# Altium schematic sheet Antenna_base.SchDoc
size A2
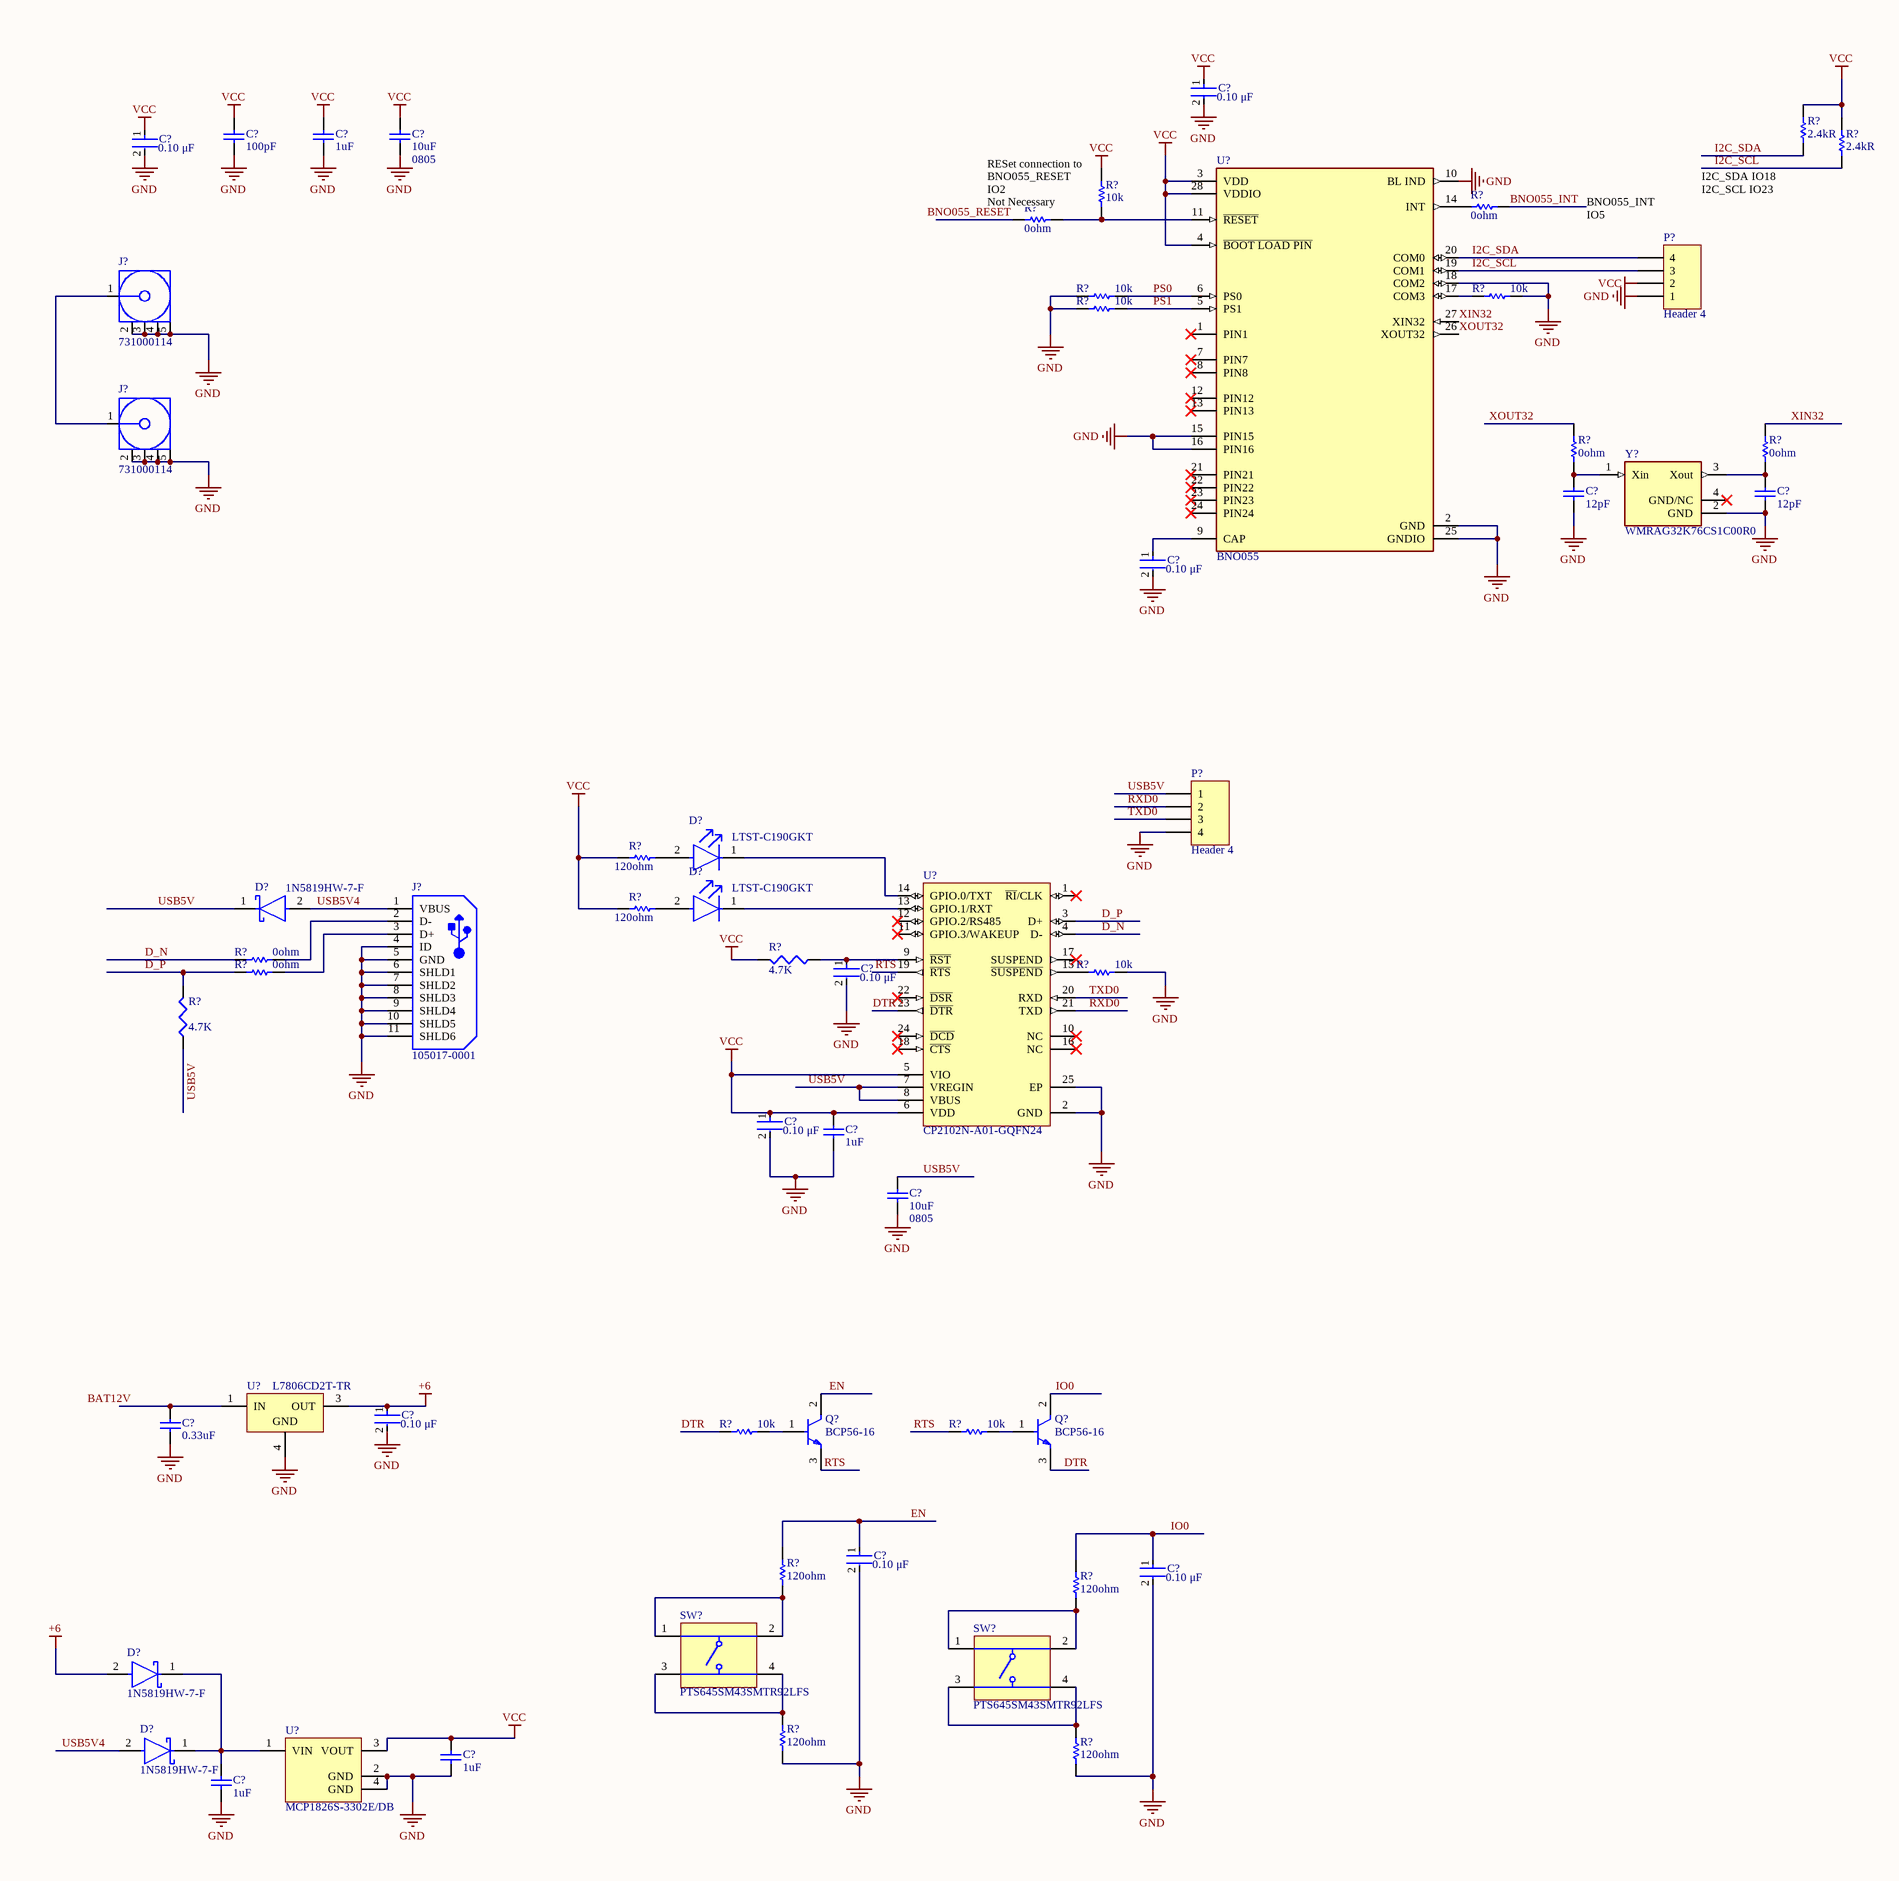
[diagram p0: Antenna_base.SchDoc, left]
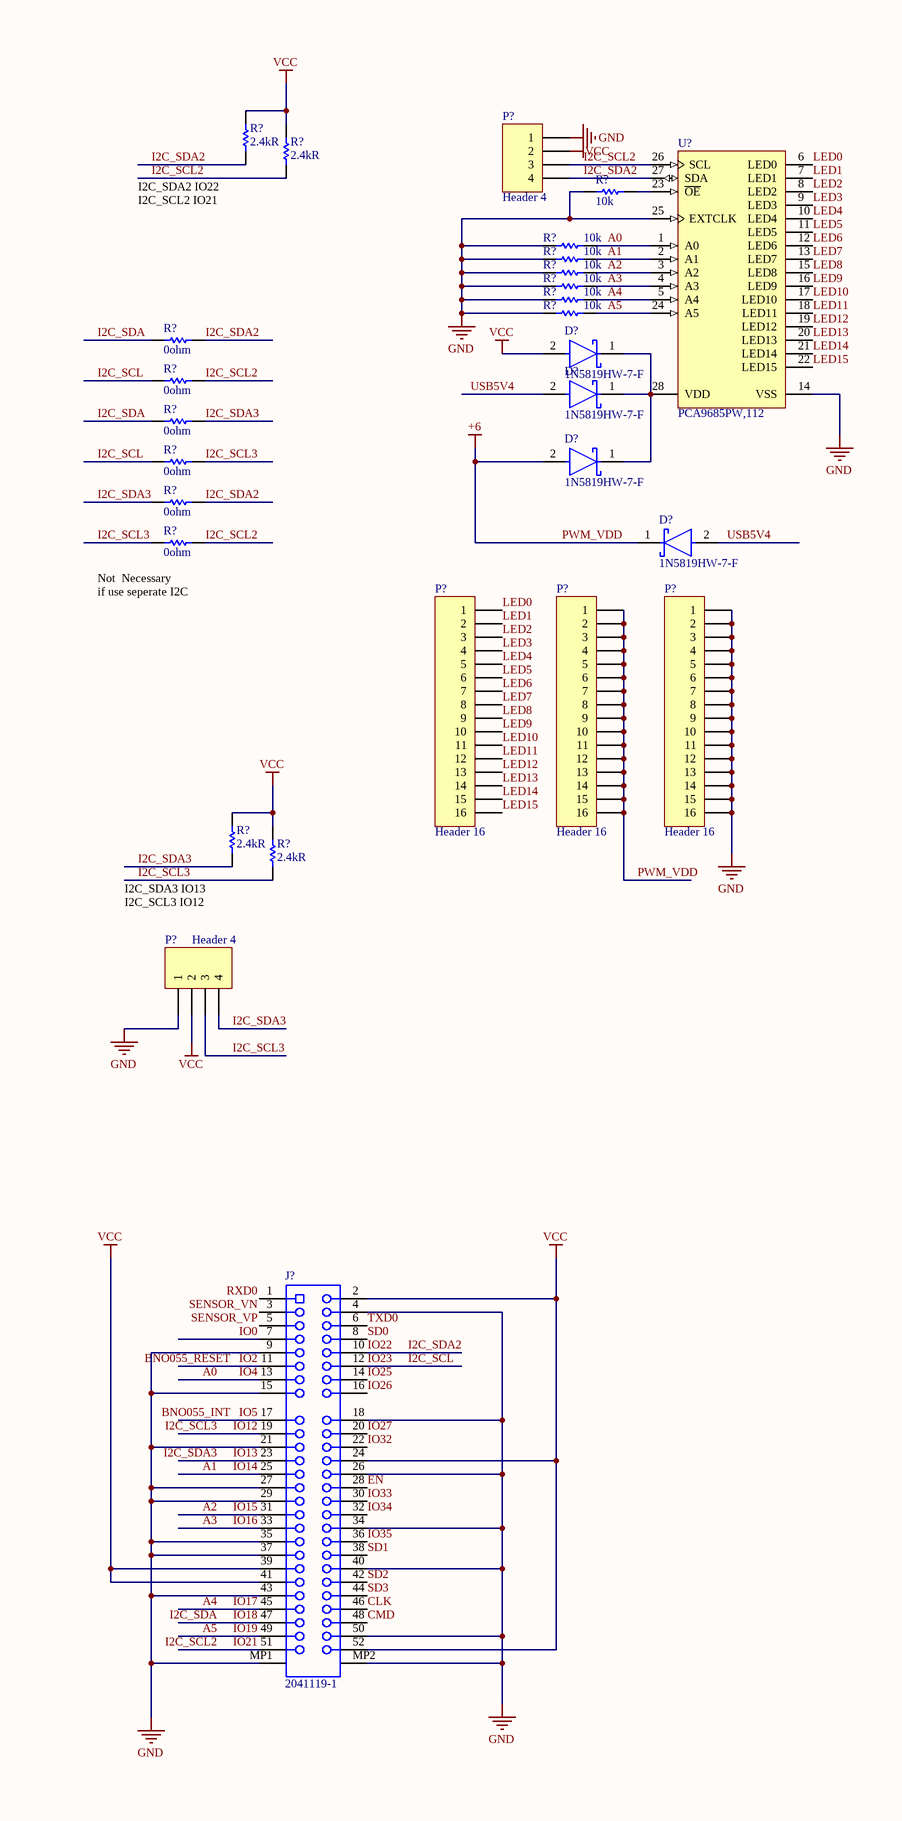
[diagram p1: Antenna_base.SchDoc, right]

## Parts
(Parts that share a designator on the sheet are numbered #1, #2 ... from top to bottom, then left to right.)
C?#1  Capacitance: 0.10 μF  [FP-C0603C-CF-MFG]  (hidden comment: C0603C104M4RAC7411)
C?#2  Capacitance: 0.10 μF  [FP-C0603C-CF-MFG]  (hidden comment: C0603C104M4RAC7411)
C?#3  value 100pF  [CAPC1608X87X35LL15T15]  (hidden comment: C0603C101J1GACTU)
C?#4  value 1uF  [CAPC1608X87X35LL15T15]  (hidden comment: C0603C101J1GACTU)
C?#5  value 10uF  Package: 0805  [CAPC2013X135X50LL10T20]  (hidden comment: GRM21BR61C106KE15L)
C?#6  value 12pF  [CAPC1608X90X40NL10T20]  (hidden comment: CC0603JRNPO9BN120)
C?#7  value 12pF  [CAPC1608X90X40NL10T20]  (hidden comment: CC0603JRNPO9BN120)
C?#8  Capacitance: 0.10 μF  [FP-C0603C-CF-MFG]  (hidden comment: C0603C104M4RAC7411)
C?#9  Capacitance: 0.10 μF  [FP-C0603C-CF-MFG]  (hidden comment: C0603C104M4RAC7411)
C?#10  Capacitance: 0.10 μF  [FP-C0603C-CF-MFG]  (hidden comment: C0603C104M4RAC7411)
C?#11  value 1uF  [CAPC1608X87X35LL15T15]  (hidden comment: C0603C101J1GACTU)
C?#12  value 10uF  Package: 0805  [CAPC2013X135X50LL10T20]  (hidden comment: GRM21BR61C106KE15L)
C?#13  Capacitance: 0.10 μF  [FP-C0603C-CF-MFG]  (hidden comment: C0603C104M4RAC7411)
C?#14  value 0.33uF  [CAPC1608X90X20LL10]  (hidden comment: C1608X7R1H334K080AC)
C?#15  Capacitance: 0.10 μF  [FP-C0603C-CF-MFG]  (hidden comment: C0603C104M4RAC7411)
C?#16  Capacitance: 0.10 μF  [FP-C0603C-CF-MFG]  (hidden comment: C0603C104M4RAC7411)
C?#17  value 1uF  [CAPC1608X87X35LL15T15]  (hidden comment: C0603C101J1GACTU)
C?#18  value 1uF  [CAPC1608X87X35LL15T15]  (hidden comment: C0603C101J1GACTU)
D?#1  1N5819HW-7-F  [FP-SOD123-MFG]
D?#2  1N5819HW-7-F  [FP-SOD123-MFG]
D?#3  1N5819HW-7-F  [FP-SOD123-MFG]
D?#4  1N5819HW-7-F  [FP-SOD123-MFG]
D?#5  LTST-C190GKT  [FP-LTST-C190GKT-MFG]
D?#6  1N5819HW-7-F  [FP-SOD123-MFG]
D?#7  LTST-C190GKT  [FP-LTST-C190GKT-MFG]
D?#8  1N5819HW-7-F  [FP-SOD123-MFG]
D?#9  1N5819HW-7-F  [FP-SOD123-MFG]
J?#1  731000114  [MOLX-731000114_V]
J?#2  731000114  [MOLX-731000114_V]
J?#3  105017-0001  [USB-MICRO-B_V]
J?#4  2041119-1  [TECO-2041119-1_3_V]
P?#1  Header 4  [HDR1X4]
P?#2  Header 4  [HDR1X4]
P?#3  Header 16  [HDR1X16]
P?#4  Header 16  [HDR1X16]
P?#5  Header 16  [HDR1X16]
P?#6  Header 4  [HDR1X4]
P?#7  Header 4  [HDR1X4]
Q?#1  BCP56-16  [FP-SOT-223-P008-MFG]
Q?#2  BCP56-16  [FP-SOT-223-P008-MFG]
R?#1  value 2.4kR  [RESC1608X50X30ML20T20]  (hidden comment: RR0816P-242-D)
R?#2  value 2.4kR  [RESC1608X50X30ML20T20]  (hidden comment: RR0816P-242-D)
R?#3  value 2.4kR  [RESC1608X50X30ML20T20]  (hidden comment: RR0816P-242-D)
R?#4  value 2.4kR  [RESC1608X50X30ML20T20]  (hidden comment: RR0816P-242-D)
R?#5  value 10k  [RESC1609X55X30LL15T15]  (hidden comment: ERJ3EKF1002V)
R?#6  value 10k  [RESC1609X55X30LL15T15]  (hidden comment: ERJ3EKF1002V)
R?#7  value 0ohm  [RESC1608X55X25ML10T15]  (hidden comment: RC0603JR-070RL)
R?#8  value 0ohm  [RESC1608X55X25ML10T15]  (hidden comment: RC0603JR-070RL)
R?#9  value 10k  [RESC1609X55X30LL15T15]  (hidden comment: ERJ3EKF1002V)
R?#10  value 10k  [RESC1609X55X30LL15T15]  (hidden comment: ERJ3EKF1002V)
R?#11  value 10k  [RESC1609X55X30LL15T15]  (hidden comment: ERJ3EKF1002V)
R?#12  value 10k  [RESC1609X55X30LL15T15]  (hidden comment: ERJ3EKF1002V)
R?#13  value 10k  [RESC1609X55X30LL15T15]  (hidden comment: ERJ3EKF1002V)
R?#14  value 10k  [RESC1609X55X30LL15T15]  (hidden comment: ERJ3EKF1002V)
R?#15  value 10k  [RESC1609X55X30LL15T15]  (hidden comment: ERJ3EKF1002V)
R?#16  value 10k  [RESC1609X55X30LL15T15]  (hidden comment: ERJ3EKF1002V)
R?#17  value 10k  [RESC1609X55X30LL15T15]  (hidden comment: ERJ3EKF1002V)
R?#18  value 0ohm  [RESC1608X55X25ML10T15]  (hidden comment: RC0603JR-070RL)
R?#19  value 0ohm  [RESC1608X55X25ML10T15]  (hidden comment: RC0603JR-070RL)
R?#20  value 0ohm  [RESC1608X55X25ML10T15]  (hidden comment: RC0603JR-070RL)
R?#21  value 0ohm  [RESC1608X55X25ML10T15]  (hidden comment: RC0603JR-070RL)
R?#22  value 0ohm  [RESC1608X55X25ML10T15]  (hidden comment: RC0603JR-070RL)
R?#23  value 0ohm  [RESC1608X55X25ML10T15]  (hidden comment: RC0603JR-070RL)
R?#24  value 0ohm  [RESC1608X55X25ML10T15]  (hidden comment: RC0603JR-070RL)
R?#25  value 0ohm  [RESC1608X55X25ML10T15]  (hidden comment: RC0603JR-070RL)
R?#26  value 2.4kR  [RESC1608X50X30ML20T20]  (hidden comment: RR0816P-242-D)
R?#27  value 2.4kR  [RESC1608X50X30ML20T20]  (hidden comment: RR0816P-242-D)
R?#28  value 120ohm  [RESC1608X55X30NL20T20]  (hidden comment: ERA-3AEB121V)
R?#29  value 120ohm  [RESC1608X55X30NL20T20]  (hidden comment: ERA-3AEB121V)
R?#30  value 0ohm  [RESC1608X55X25ML10T15]  (hidden comment: RC0603JR-070RL)
R?#31  value 0ohm  [RESC1608X55X25ML10T15]  (hidden comment: RC0603JR-070RL)
R?#32  4.7k  [J1-0603]
R?#33  value 10k  [RESC1609X55X30LL15T15]  (hidden comment: ERJ3EKF1002V)
R?#34  4.7k  [J1-0603]
R?#35  value 10k  [RESC1609X55X30LL15T15]  (hidden comment: ERJ3EKF1002V)
R?#36  value 10k  [RESC1609X55X30LL15T15]  (hidden comment: ERJ3EKF1002V)
R?#37  value 120ohm  [RESC1608X55X30NL20T20]  (hidden comment: ERA-3AEB121V)
R?#38  value 120ohm  [RESC1608X55X30NL20T20]  (hidden comment: ERA-3AEB121V)
R?#39  value 120ohm  [RESC1608X55X30NL20T20]  (hidden comment: ERA-3AEB121V)
R?#40  value 120ohm  [RESC1608X55X30NL20T20]  (hidden comment: ERA-3AEB121V)
SW?#1  PTS645SM43SMTR92LFS  [ITT-PTS645S-4_V]
SW?#2  PTS645SM43SMTR92LFS  [ITT-PTS645S-4_V]
U?#1  PCA9685PW,112  [SOT361-1_V]
U?#2  BNO055  [FP-BNO055-MFG]
U?#3  CP2102N-A01-GQFN24  [SLAB-QFN-24-2550x2550TP_A_V]
U?#4  L7806CD2T-TR  [TO-263_L]
U?#5  MCP1826S-3302E/DB  [SOT-223-DB3_L]
Y?  WMRAG32K76CS1C00R0  [FP-WMRAG32K76CS1C00R0-MFG]

## Nets
GND: C?#1.2 C?#2.2 C?#3.1 C?#4.1 C?#5.1 C?#6.1 C?#7.1 C?#8.2 C?#9.2 C?#10.2 C?#11.1 C?#12.1 C?#13.2 C?#14.1 C?#15.2 C?#16.2 C?#17.1 C?#18.1 J?#1.2 J?#1.3 J?#1.4 J?#1.5 J?#2.2 J?#2.3 J?#2.4 J?#2.5 J?#3.4(ID) J?#3.5(GND) J?#3.6(SHLD1) J?#3.7(SHLD2) J?#3.8(SHLD3) J?#3.9(SHLD4) J?#3.10(SHLD5) J?#3.11(SHLD6) J?#4.4 J?#4.9 J?#4.15 J?#4.18 J?#4.21 J?#4.26 J?#4.27 J?#4.29 J?#4.34 J?#4.35 J?#4.37 J?#4.40 J?#4.43 J?#4.50 J?#4.MP1 J?#4.MP2 P?#1.1 P?#2.1 P?#5.1 P?#5.2 P?#5.3 P?#5.4 P?#5.5 P?#5.6 P?#5.7 P?#5.8 P?#5.9 P?#5.10 P?#5.11 P?#5.12 P?#5.13 P?#5.14 P?#5.15 P?#5.16 P?#6.4 P?#7.1 R?#5.2 R?#9.2 R?#10.2 R?#11.2 R?#12.2 R?#13.2 R?#14.1 R?#15.1 R?#16.2 R?#17.1 R?#33.2 R?#39.1 R?#40.1 U?#1.14(VSS) U?#1.25(EXTCLK) U?#2.2(GND) U?#2.10(BL_IND) U?#2.15(PIN15) U?#2.16(PIN16) U?#2.18(COM2) U?#2.25(GNDIO) U?#3.2(GND) U?#3.25(EP) U?#4.4(GND) U?#5.2(GND) U?#5.4(GND) Y?.2(GND)
PWM_VDD: C?#13.1 D?#3.2(A) D?#4.1(C) D?#8.2(A) P?#4.1 P?#4.2 P?#4.3 P?#4.4 P?#4.5 P?#4.6 P?#4.7 P?#4.8 P?#4.9 P?#4.10 P?#4.11 P?#4.12 P?#4.13 P?#4.14 P?#4.15 P?#4.16 U?#4.3(OUT)  [also labelled +6]
VCC: C?#1.1 C?#2.1 C?#3.2 C?#4.2 C?#5.2 C?#10.1 C?#11.2 C?#17.2 D?#1.2(A) J?#4.2 J?#4.24 J?#4.39 J?#4.41 J?#4.52 P?#1.2 P?#2.2 P?#7.2 R?#1.2 R?#2.2 R?#3.2 R?#4.2 R?#6.2 R?#26.2 R?#27.2 R?#28.1 R?#29.1 R?#32.2 U?#2.3(VDD) U?#2.4(~{BOOT_LOAD_PIN}) U?#2.28(VDDIO) U?#3.5(VIO) U?#3.6(VDD) U?#5.3(VOUT)
A0: J?#4.13 R?#9.1 U?#1.1(A0)  [also labelled IO4]
A1: J?#4.25 R?#10.1 U?#1.2(A1)  [also labelled IO14]
A2: J?#4.31 R?#11.1 U?#1.3(A2)  [also labelled IO15]
A3: J?#4.33 R?#12.1 U?#1.4(A3)  [also labelled IO16]
A4: J?#4.45 R?#13.1 U?#1.5(A4)  [also labelled IO17]
A5: J?#4.49 R?#16.1 U?#1.24(A5)  [also labelled IO19]
BAT12V: C?#14.2 U?#4.1(IN)
BNO055_INT: J?#4.17 R?#7.2  [also labelled IO5]
BNO055_RESET: J?#4.11 R?#8.1  [also labelled IO2]
CLK: J?#4.46
CMD: J?#4.48
D_N: R?#30.1 U?#3.4(D-)
D_P: R?#31.1 R?#34.2 U?#3.3(D+)
DTR: Q?#2.3(E) R?#35.1 U?#3.23(~{DTR})
EN: C?#15.1 J?#4.28 Q?#1.2(C) R?#37.2
I2C_SCL: J?#4.12 P?#2.3 R?#3.1 R?#19.1 R?#23.1 U?#2.19(COM1)  [also labelled IO23]
I2C_SCL2: J?#4.51 P?#1.3 R?#4.1 R?#19.2 R?#25.2 U?#1.26(SCL)  [also labelled IO21]
I2C_SCL3: J?#4.19 P?#7.3 R?#23.2 R?#25.1 R?#27.1  [also labelled IO12]
I2C_SDA: J?#4.47 P?#2.4 R?#1.1 R?#18.1 R?#20.1 U?#2.20(COM0)  [also labelled IO18]
I2C_SDA2: J?#4.10 P?#1.4 R?#2.1 R?#18.2 R?#24.2 U?#1.27(SDA)  [also labelled IO22]
I2C_SDA3: J?#4.23 P?#7.4 R?#20.2 R?#24.1 R?#26.1  [also labelled IO13]
IO0: C?#16.1 J?#4.7 Q?#2.2(C) R?#38.2
IO25: J?#4.14
IO26: J?#4.16
IO27: J?#4.20
IO32: J?#4.22
IO33: J?#4.30
IO34: J?#4.32
IO35: J?#4.36
LED0: P?#3.1 U?#1.6(LED0)
LED1: P?#3.2 U?#1.7(LED1)
LED2: P?#3.3 U?#1.8(LED2)
LED3: P?#3.4 U?#1.9(LED3)
LED4: P?#3.5 U?#1.10(LED4)
LED5: P?#3.6 U?#1.11(LED5)
LED6: P?#3.7 U?#1.12(LED6)
LED7: P?#3.8 U?#1.13(LED7)
LED8: P?#3.9 U?#1.15(LED8)
LED9: P?#3.10 U?#1.16(LED9)
LED10: P?#3.11 U?#1.17(LED10)
LED11: P?#3.12 U?#1.18(LED11)
LED12: P?#3.13 U?#1.19(LED12)
LED13: P?#3.14 U?#1.20(LED13)
LED14: P?#3.15 U?#1.21(LED14)
LED15: P?#3.16 U?#1.22(LED15)
PS0: R?#14.2 U?#2.6(PS0)
PS1: R?#17.2 U?#2.5(PS1)
RTS: Q?#1.3(E) R?#36.1 U?#3.19(~{RTS})
RXD0: J?#4.1 P?#6.2 U?#3.21(TXD)
SD0: J?#4.8
SD1: J?#4.38
SD2: J?#4.42
SD3: J?#4.44
SENSOR_VN: J?#4.3
SENSOR_VP: J?#4.5
TXD0: J?#4.6 P?#6.3 U?#3.20(RXD)
USB5V: C?#12.2 D?#6.1(C) P?#6.1 R?#34.1 U?#3.7(VREGIN) U?#3.8(VBUS)
USB5V4: D?#2.2(A) D?#4.2(A) D?#6.2(A) D?#9.2(A) J?#3.1(VBUS)
XIN32: R?#22.1 U?#2.27(XIN32)
XOUT32: R?#21.1 U?#2.26(XOUT32)
NetC?#6_2: C?#6.2 R?#21.2 Y?.1(Xin)
NetC?#7_2: C?#7.2 R?#22.2 Y?.3(Xout)
NetC?#8_1: C?#8.1 U?#2.9(CAP)
NetC?#9_1: C?#9.1 R?#32.1 U?#3.9(~{RST})
NetC?#18_2: C?#18.2 D?#8.1(C) D?#9.1(C) U?#5.1(VIN)
NetD?#1_1: D?#1.1(C) D?#2.1(C) D?#3.1(C) U?#1.28(VDD)
NetD?#5_1: D?#5.1(C) U?#3.14(GPIO.0/TXT)
NetD?#5_2: D?#5.2(A) R?#28.2
NetD?#7_1: D?#7.1(C) U?#3.13(GPIO.1/RXT)
NetD?#7_2: D?#7.2(A) R?#29.2
NetJ?#1_1: J?#1.1 J?#2.1
NetJ?#3_2: J?#3.2(D-) R?#30.2
NetJ?#3_3: J?#3.3(D+) R?#31.2
NetQ?#1_1: Q?#1.1(B) R?#35.2
NetQ?#2_1: Q?#2.1(B) R?#36.2
NetR?#5_1: R?#5.1 U?#1.23(~{OE})
NetR?#6_1: R?#6.1 R?#8.2 U?#2.11(~{RESET})
NetR?#7_1: R?#7.1 U?#2.14(INT)
NetR?#15_2: R?#15.2 U?#2.17(COM3)
NetR?#33_1: R?#33.1 U?#3.15(~{SUSPEND})
NetR?#37_1: R?#37.1 SW?#1.1 SW?#1.2
NetR?#38_1: R?#38.1 SW?#2.1 SW?#2.2
NetR?#39_2: R?#39.2 SW?#1.3 SW?#1.4
NetR?#40_2: R?#40.2 SW?#2.3 SW?#2.4

Not connected (* = marked no-connect by the designer): U?#2 1(PIN1)* 7(PIN7)* 8(PIN8)* 12(PIN12)* 13(PIN13)* 21(PIN21)* 22(PIN22)* 23(PIN23)* 24(PIN24)*; U?#3 1(~{RI}/CLK)* 10(NC)* 11(GPIO.3/WAKEUP)* 12(GPIO.2/RS485)* 16(NC)* 17(SUSPEND)* 18(~{CTS})* 22(~{DSR})* 24(~{DCD})*; Y? 4(GND/NC)*

## Notes on the sheet
- (near R?#6) RESet connection to
  BNO055_RESET IO2
  Not Necessary
- (near P?#2) BNO055_INT
  IO5
- (near R?#1) I2C_SDA IO18
  I2C_SCL IO23
- (near R?#2) I2C_SDA2 IO22
  I2C_SCL2 IO21
- (near R?#25) Not  Necessary
  if use seperate I2C
- (near R?#26) I2C_SDA3 IO13
  I2C_SCL3 IO12
  For LCD
- Title
- Size:
- Date:
- File:
- A2
- Number:
- Time:
- Revision:
- Sheet
- of

## Library data of the parts
C?#1 C?#2 C?#8-C?#10 C?#13 C?#15 C?#16 = CMP-03020-016578-1: CAP CER 0.1UF 16V X7R 0603; Manufacturer: KEMET; Tolerance: 0.2; Value: 0.10 μF; Automotive Grade: Grade 1; Material: Ceramic; Temperature Coefficient: 30ppm/°C; RoHS: TRUE; Temperature: -55°C to +125°C; Automotive: Yes; Device Class L3: Ceramic Capacitors; Temperature Characteristic: X7R; Package: C0603C-CF; Digikey Description: CAP CER 0.1UF 16V X7R 0603; Manufacturer Part Number: C0603C104M4RAC7411; ComponentLink2URL: https://api.kemet.com/component-edge/download/datasheet/C0603C100J5GACAUTO.pdf; Mouser Description: Multilayer Ceramic Capacitors MLCC - SMD/SMT 16volts 0.1uF X7R 20%; Voltage Rating: 16 V; Temperature Range High: +125°C; Temperature Range Low: -55°C; Height: 0.87mm; Device Class L1: Passive Components; ComponentLink2Description: Datasheet; Lead Free: Yes; Category: Cap; Device Class L2: Capacitors; Octopart: https://octopart.com/c0603c104m4rac7411-kemet-9138805
C?#3 C?#4 C?#11 C?#17 C?#18 = CMP-2006-03318-1: Manufacturer: Kemet; Part Number: C0603C101J1GACTU
C?#5 C?#12 = CMP-2007-03453-1: Manufacturer: Murata; Part Number: GRM21BR61C106KE15L
C?#6 C?#7 = CMP-1659-00031-1: Chip Capacitor, 12 pF, +/- 5%, 50 V, -55 to 125 degC, 0603 (1608 Metric), RoHS, Tape and Reel; Tolerance: 1%; Voltage Rating: 250 V; Case\Package: Axial; Power Rating: 250 mW; Resistance: 475 kohm; Mount: Through Hole; Length: 0.248 inch; PackageReference: 0603; DatasheetVersion: Rev. 14, 07/2016; Packaging: Bulk; Max Operating Temperature: 155 degC; Min Operating Temperature: -55 degC; ComponentLink2Description: Datasheet; ComponentLink2URL: http://www.yageo.com/NewPortal/yageodocoutput?fileName=/pdf/MLCC/UPY-GP_NP0_16V-to-50V_14.pdf; ComponentLink1URL: http://www.yageo.com/; PackageDescription: 2-Pin Surface Mount Device, Body 1.6 x 0.8 mm; Package Quantity: 200; RoHSCompliant: true; ComponentLink1Description: Manufacturer URL
C?#14 = CMP-2000-07551-1: Chip Capacitor, 0.33 uF, +/- 10%, 50 V, -55 to 125 degC, 0603 (1608 Metric), RoHS, Tape and Reel; Manufacturer: TDK; Datasheet URL: https://product.tdk.com/info/en/catalog/datasheets/mlcc_commercial_general_en.pdf; Manufacturer URL: http://www.tdk.com/; Package Description: 2-Pin Surface Mount Device, Body 1.6 x 0.8 mm; Mounting Technology: SurfaceMount; Datasheet Version: 07/2017; Package Reference: 603
D?#1-D?#4 D?#6 D?#8 D?#9 = CMP-12790-000018-1: DIODE SCHOTTKY 40V 1A SOD123; Manufacturer: Diodes Inc; Max Surge Forward Current: 25A; Peak Reverse Current: 1mA; Max Junction Temp: +125°C; Import Ts: 1521843113; Vr V: 40; Standoff Height: 0mm; Capacitance: 50pF; Value: 50pF; Ciiva Ids: 815630; If A: 1; Automotive: No; Device Class L1: Discrete Semiconductors; Octopart: https://octopart.com/1n5819hw-7-f-diodes+inc.-323197; Terminal Temperature Tt Degc: 90; ComponentLink2Description: Datasheet; Temperature Range High: +125°C; Package: SOD123; Reverse Voltage: 40V; Temperature Range Low: -65°C; Mouser Description: 1N5819HW Series 40 V 1 A Surface Mount Schottky Barrier Rectifier - SOD-123; Device Class L2: Diodes; Lead Free: Yes; Max Repetitive Reverse Voltage: 40V; Ipc Land Pattern Name: SOD365155X123-2; Forward Current: 1A; Device Class L3: Schottky Diodes; Digikey Description: DIODE SCHOTTKY 40V 1A SOD123; ComponentLink2URL: https://www.diodes.com/assets/Datasheets/ds30217.pdf; Footprint Url: https://www.diodes.com/assets/Package-Files/SOD123.pdf; RoHS: TRUE; Category: Diode; Height: 1.45mm; Release Date: 1385348939; Manufacturer Part Number: 1N5819HW-7-F; Temperature: -65°C to +125°C
D?#5 D?#7 = CMP-22017-000005-1: LED GREEN CLEAR CHIP SMD; Reverse Voltage: 5V; Power Dissipation: 100mW; Forward Voltage: 2.1V; Test Current: 10mA; Number of LEDs: 1; Viewing Angle: 130°; Forward Current: 30mA; Voltage: 2V; Wavelength: 565nm; Dominant Wavelength: 569nm; Luminous Intensity: 6mcd; Lens Color: Colorless; Packaging: Tape and Reel; Lens Transparency: Clear; Min Operating Temperature: -55°C; Case Code (Metric): 1608; Lens Style: Clear; Case/Package: 0603; Mount: Surface Mount; Package Quantity: 1; Height: 0.8mm; Illumination Color: Green; Radiation Hardening: No; Depth: 0.8mm; Number of Pins: 2; Max Operating Temperature: 85°C; Color: Green; Number of Elements: 1; Power Rating: 100mW; Case Code (Imperial): 0603; Width: 0.8mm; Length: 1.6mm; Lead Free: Lead Free
J?#1 J?#2 = CMP-2000-05487-1: SMA Right-Angle PCB Jack Receptacle, Brass Body, Gold Plated, 50 Ohm, 5-Pin THD, RoHS, Tray; Manufacturer: Molex; Datasheet Version: 09/2016; Package Description: 5-Pin Through Hole Device, Body 14.8 x 6.35 mm, Pitch 2.54 mm; Datasheet URL: http://www.molex.com/webdocs/datasheets/pdf/en-us/0731000114_RF_COAX_CONNECTORS.pdf; Manufacturer URL: http://www.molex.com/; Package Reference: 731000114; Mounting Technology: ThroughHole; Package URL: http://www.molex.com/pdm_docs/sd/731000114_sd.pdf
J?#3 = CMP-2000-05827-1: Micro-USB B Receptacle, Right Angle, Bottom Mount, Surface Mount, with Solder Tabs, -30 to 85 degC, 5-Pin USB, RoHS, Tape and Reel; Manufacturer: Molex; Featured Product: Micro-USBConnectorsUSBConnectors; Other Names: WM1399DKR; Package Version: Rev. F, 12/2012; Number of Contacts: 5; Connector Type: USB-microB; Catalog Drawings: 1050170001; 3D Model: 105017-0001.stp; Mating Products: WM17145-ND-CABLEMICROUSBBTOSTDA1.0MWM17147-ND-CABLEMICROUSBBTOSTDA2.0MWM17146-ND-CABLEMICROUSBBTOSTDA1.5M; PCN Assembly/Origin: ResinSupplier21/Oct/2015; Voltage - Max: 30V; Online Catalog: Molex-MicroUSB; Manufacturer URL: http://www.molex.com/; Package Description: 5-Leads USB, Micro B, Body 7.5 x 5 mm, Pitch 0.65 mm; Datasheet URL: http://www.molex.com/elqNow/elqRedir.htm?ref=http://www.molex.com/webdocs/datasheets/pdf/en-us/1050170001_IO_CONNECTORS.pdf; Ingress Protection: -; Datasheet Version: 03/2016; Mounting Type: BoardCutout,SurfaceMount,RightAngle; Circuits: 5; Standard Package: 1; Package Reference: MICRO-B; Package URL: http://www.molex.com/pdm_docs/sd/1050170001_sd.pdf; Category: Connectors,Interconnects; Series: -; RoHS Information: 1050170001CertofCompliance; Features: Shielded,SolderRetention; Family: USB,DVI,HDMIConnectors; Specifications: -; Gender: Receptacle; Packaging: Digi-Reel®; Mounting Technology: SurfaceMount
J?#4 = CMP-2011-00000-2: mSATA & PCI Express Mini Card Connector, Pitch 0.4 mm, 52 Position, Height 4 mm, RoHS, Tape and Reel; Manufacturer: TE Connectivity; Case\Package: SMD; Rows: 2; Contacts: 52; Contact Material: Copper; Orientation: RightAngle; Width: 9.02mm; Mounting Technology: SurfaceMount; ELV: Compliant; Contact Plating: Gold; Termination: Solder; Datasheet URL: http://www.te.com/commerce/DocumentDelivery/DDEController?Action=showdoc&DocId=Customer+Drawing%7F2041119%7FD%7Fpdf%7FEnglish%7FENG_CD_2041119_D.pdf%7F2041119-1; Height: 4mm; Manufacturer URL: http://www.te.com/; Datasheet Version: 06/2016; RoHSCompliant: true; Length: 29.9mm; Package Description: mSATA & PCI Express Mini Card Connector, Pitch 0.4 mm, 52 Position, Height 4 mm; Housing Colour: Black; Housing Material: Polymer; Packaging: TapeandReel; Mount: SurfaceMount; Radiation Hardening: No; Package Reference: 2041119-1_3; Poles: 52
P?#1 P?#2 P?#6 P?#7 = Header 4: Header, 4-Pin; LatestRevisionDate: 17-Jul-2002; LatestRevisionNote: Re-released for DXP Platform.; Publisher: Altium Limited
P?#3-P?#5 = Header 16: Header, 16-Pin; LatestRevisionDate: 17-Jul-2002; LatestRevisionNote: Re-released for DXP Platform.; Publisher: Altium Limited
Q?#1 Q?#2 = CMP-12195-000003-1: TRANS NPN 80V 1A SOT-223; Manufacturer: STMicroelectronics; Number Of Npn: 1; Hfe Max: 250; Hfe Min: 100; Power Dissipation: 1.6W; Collector Base Voltage: 100V; Emitter Base Voltage: 5V; Max Junction Temp: +150°C; Rthja Max: 78°C/W; Standoff Height: 0.02mm; Collector Emitter Saturation Voltage: 0.5V; Hfe Testvce: 2V; Hfe Testic: 150mA; Package: SOT-223-P008; Octopart: https://octopart.com/bcp56-16-stmicroelectronics-13883839; Digikey Description: TRANS NPN 80V 1A SOT-223; RoHS: TRUE; Device Class L1: Discrete Semiconductors; Manufacturer Part Number: BCP56-16; Collector Emitter Voltage: 80V; Mouser Description: BCP56 Series 80 V 1 A 1.6 W Surface Mount Low Power NPN Transistor - SOT-223; Collector Emitter Breakdown Voltage: 80V; Category: Trans; Automotive: No; Ipc Land Pattern Name: SOT230P700X180-4; Temperature: to +150°C; Number Of Elements: 1; Footprint Url: https://www.st.com/content/ccc/resource/technical/document/application_note/45/cc/69/ea/2f/8d/4e/3c/CD00004438.pdf/files/CD00004438.pdf/jcr:content/translations/en.CD00004438.pdf; ComponentLink2URL: https://www.st.com/resource/en/datasheet/bcp56-16.pdf; Device Class L2: Transistors; Temperature Range High: +150°C; Device Class L3: BJTs; Height: 1.82mm; ComponentLink2Description: Datasheet; Lead Free: Yes; Max Collector Current: 1A
R?#1-R?#4 R?#26 R?#27 = CMP-2000-02561-1: Manufacturer: Susumu; Part Number: RR0816P-242-D
R?#5 R?#6 R?#9-R?#17 R?#33 R?#35 R?#36 = CMP-2000-07452-1: Chip Resistor, 10 KOhm, +/- 1%, 0.1 W, -55 to 155 degC, 0603 (1608 Metric), RoHS, Tape and Reel; Manufacturer: Panasonic; Voltage Rating: 75V; Case\/Package: 0603; Power Rating: 100mW; Resistance: 10KOhm; Temperature Coefficient: 100ppm\/degreesC; Number of Pins: 2; Package Reference: 603; Depth: 0.8mm; Mount: SurfaceMount; Package Description: 2-Pin Surface Mount Device, Body 1.6 x 0.85 mm; Datasheet Version: 02/2017; Length: 1.6mm; Lead Free: LeadFree; Height: 0.45mm; Number of Terminations: 2; Max Power Dissipation: 100mW; Min Operating Temperature: -55degC; Datasheet URL: https://industrial.panasonic.com/cdbs/www-data/pdf/RDA0000/AOA0000C304.pdf; Termination: SMD/SMT; Case Code (Metric): 1608; Case Code (Imperial): 0603; Tolerance: 1%; Max Operating Temperature: 155degC; RoHSCompliant: true; Voltage Rating (DC): 75V; Radiation Hardening: No; Packaging: TapeandReel; Composition: ThickFilm; Mounting Technology: SurfaceMount; Manufacturer URL: http://www.panasonic.com/; Width: 0.031inch; REACH SVHC: NoSVHC; Contact Plating: Tin; Military Standard: Not; Package Quantity: 1
R?#7 R?#8 R?#18-R?#25 R?#30 R?#31 = CMP-2100-03667-1: Chip Resistor, 0 Ohm, +/- 5%, 0.1 W, -55 to 155 degC, 0603 (1608 Metric), RoHS, Tape and Reel; Manufacturer: Yageo; Temperature Coefficient: 200ppm/degreesC; Voltage Rating: 50V; Power Rating: 100mW; Resistance: 0mOhm; Width: 0.8mm; Max Operating Temperature: 155degC; Tolerance: 5%; Package Reference: 0603; Height: 0.45mm; Depth: 0.8mm; Package Description: 2-Pin Surface Mount Device, Body 1.6 x 0.8 mm; Termination: SMD/SMT; Package Quantity: 5000; Case/Package: 0603; Case Code (Imperial): 0603; Radiation Hardening: No; Number of Pins: 2; Length: 1.6mm; Lead Free: LeadFree; Voltage Rating (DC): 50V; Military Standard: Not; Datasheet URL: http://www.yageo.com/NewPortal/yageodocoutput?fileName=/pdf/R-Chip/PYu-RC_Group_51_RoHS_L_5.pdf; Manufacturer URL: http://www.yageo.com/; Packaging: TapeandReel; Case Code (Metric): 1608; Min Operating Temperature: -55degC; Composition: ThickFilm; RoHSCompliant: true; Contact Plating: Tin; Datasheet Version: Rev. 5, 10/2016; REACH SVHC: NoSVHC
R?#28 R?#29 R?#37-R?#40 = CMP-2000-00896-1: Manufacturer: Panasonic; Part Number: ERA-3AEB121V
R?#32 R?#34 = Res3: Resistor; Published: 8-Jun-2000; LatestRevisionDate: 29-May-2009; LatestRevisionNote: IPC-7351 Footprint Added.; PackageReference: J1-0603; Publisher: Altium Limited; PackageDescription: Chip Resistor; Value: 4.7K
SW?#1 SW?#2 = CMP-2000-05160-1: 6 mm Tact Switche, SPST, NO, -20 to 60 degC, 4-Pin SMT, RoHS, Tape and Reel; Manufacturer: ITT Cannon; Manufacturer URL: http://www.ittcannon.com/; Datasheet Version: Feb-14; Datasheet URL: https://datasheet.ciiva.com/29903/getdatasheetpartid-786341-29903846.pdf
U?#1 = CMP-1595-00004-2: 16-Channel, 12-Bit PWM Fm+ I2C-Bus LED Controller, 2.3 to 5.5 V, -40 to 85 degC, 28-Pin TSSOP (SOT361-1), RoHS, Tape and Reel; Supply Current Max: 10 mA; Supply Voltage Min: 2.3 V; Supply Voltage Max: 5.5 V; Frequency: 25000000 Hz; Temperature Min: -40 degC; PackageDescription: 28-Pin Small Outline Package, Body 9.7 x 4.4 mm, Pitch 0.65 mm; RoHS: TRUE; ComponentLink1Description: Manufacturer URL; Code_JEDEC: MO-153; PartNumber: PCA9685; ComponentLink2URL: http://www.nxp.com/documents/data_sheet/PCA9685.pdf; Packing: Tape and Reel; ComponentLink1URL: http://www.nxp.com/; ComponentLink3Description: Package Specification; ComponentLink2Description: Datasheet; ComponentLink3URL: http://www.nxp.com/documents/outline_drawing/sot361-1_po.pdf; DatasheetVersion: Rev. 4; Temperature Max: 85 degC; PackageVersion: 02/2003; Mounting Technology: Surface Mount
U?#2 = CMP-191067-000002-1: IMU ACCEL/GYRO/MAG I2C 28LGA; Manufacturer: Bosch Sensortech; Max Supply Voltage: 3.6V; Voltage: 1.7~3.6V; Operating Supply Current: 12.3mA; Gyro Sensitivity: 16LSB/°/s; Sensor Type: Accelerometer,Gyroscope,Magnetometer; Accel Sensitivity: 0.001LSB/g; Min Supply Voltage: 1.7V; Accel Range: 2/4/8/16g; Accel Resolution: 14bits; Sensor Output: I2C,UART; Gyro Range: 125/250/500/1000/2000°/s; Mag Sense Range: 1300-2500uT; Octopart: https://octopart.com/bno055-bosch+sensortec-50309911; Height: 1.18mm; Automotive: No; Mouser Description: BNO055 Series 1.7 to 3.6 V Intelligent 9-Axis Absolute Orientation Sensor-LGA-28; Lead Free: Yes; Temperature Range High: +85°C; Ambient Temperature Range Low: -40°C; Ambient Temperature Range High: +85°C; Device Class L1: Sensors; Device Class L3: Inertial Measurement Units (IMUs); ComponentLink2URL: https://ae-bst.resource.bosch.com/media/_tech/media/datasheets/BST-BNO055-DS000.pdf; Temperature Range Low: -40°C; Manufacturer Part Number: BNO055; Digikey Description: IMU ACCEL/GYRO/MAG I2C 28LGA; Device Class L2: Motion Sensors; RoHS: TRUE; Category: IC; Temperature: -40°C to +85°C; ComponentLink2Description: Datasheet; Package: 0
U?#3 = CMP-2000-07570-1: USBXpress(TM) Family, 4 GPIOs, 2.2 to 3.6 V, -40 to 85 degC, 24-Pin QFN, RoHS; Manufacturer: Silicon Labs; Max Supply Voltage: 3.6V; Min Supply Voltage: 3V; Datasheet Version: Rev. 1.1, 08/2016; Max Operating Temperature: 85degC; Case\/Package: QFN; Number of Pins: 24; Min Operating Temperature: -40degC; Mounting Technology: SurfaceMount; Manufacturer URL: http://www.silabs.com/; RoHSCompliant: False; Package Reference: QFN-24-2550x2550TP_A; Datasheet URL: http://www.silabs.com/documents/public/data-sheets/cp2102n-datasheet.pdf; Package Description: 24-Pin Quad Flat No-lead Package, Body 4 x 4 mm, Pitch 0.5 mm; REACH SVHC: Unknown
U?#4 = CMP-0244-00208-1: Positive Voltage Regulator, 3-Pin D2PAK, Tape and Reel; PackageDescription: 3-Pin Transistor Outline Package 2.54 mm Pitch, 15.4 mm Lead Span (D2PAK); ComponentLink1Description: Manufacturer URL; ComponentLink2URL: http://www.st.com/internet/com/TECHNICAL_RESOURCES/TECHNICAL_LITERATURE/DATASHEET/CD00000444.pdf; ComponentLink1URL: http://www.st.com; ComponentLink2Description: Datasheet; DatasheetVersion: 16/11/2011; PackageReference: TO-263; PackageVersion: 2011
U?#5 = CMP-0136-00504-1: 1000 mA, Low Voltage, Low Quiescent Current LDO Regulator, 3-Pin SOT-223, Extended Temperature; PackageVersion: revBB, Aug-2009; PackageReference: SOT-223-DB3; DatasheetVersion: revA, Aug-2007; PackageDescription: 3-Lead Plastic Small Outline Transistor (DB) [SOT-223]
Y? = CMP-06054-000002-1: MEMS Resonator; Manufacturer: Murata; Tolerance: 20ppm; Frequency: 32.768kHz; Esr: 75kΩ; Load Capacitance: 8pF; Temperature Range High: +85°C; Manufacturer Part Number: WMRAG32K76CS1C00R0; Device Class L2: Crystals / Oscillators; Category: Crys; ComponentLink2URL: https://www.murata.com/en-us/products/productdetail?partno=WMRAG32K76CS1C00R0; Package: WMRAG32K76CS1C00R0; Temperature: -30°C to +85°C; Automotive: No; Device Class L1: Passive Components; Octopart: https://octopart.com/wmrag32k76cs1c00r0-murata-103936783; ComponentLink2Description: Datasheet; RoHS: TRUE; Lead Free: Yes; Device Class L3: Crystals; Footprint Url: https://forum.upverter.com/uploads/default/original/3X/c/9/c928dfaf44ae48bfe51164a60c1d28063cd1860b.pdf; Temperature Range Low: -30°C